# EAGLE design Universal_Board_Side_Mount (EAGLE 9.6.2)
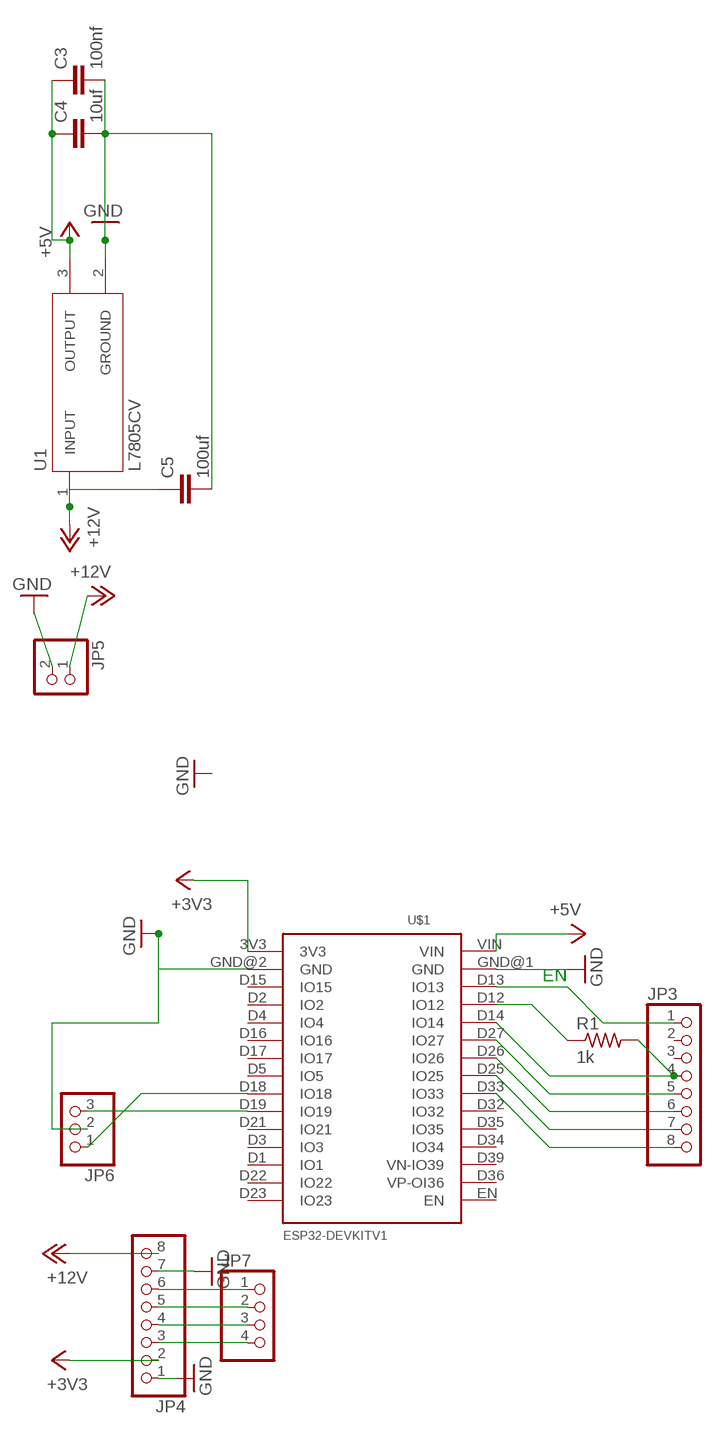
[diagram p0: schematic, sheet 1]

## Parts
C3  100nf  C2,5-3  [C2.5-3]
C4  10uf  C2,5-3  [C2.5-3]
C5  100uf  C2,5-3  [C2.5-3]
JP3  PINHD-1X8  [1X08]
JP4  PINHD-1X8  [1X08]
JP5  PINHD-1X2  [1X02]
JP6  PINHD-1X3  [1X03]
JP7  PINHD-1X4  [1X04]
R1  1k  R-US_0204/7  [0204/7]
U1  L7805CV  [TO255P1040X460X1968-3]
U$1  ESP32DEVKITV1  [ESP32-DEVKITV1]

## Nets
+3V3: JP4.2 U$1.3V3
+5V: C3.1 C4.1 U1.3(OUTPUT) U$1.VIN
+12V: C5.1 JP4.8 JP5.1 U1.1(INPUT)
GND: C3.2 C4.2 C5.2 JP4.1 JP4.7 JP5.2 JP6.2 U1.2(GROUND) U$1.GND@1(GND) U$1.GND@2(GND)
N$1: JP3.4 R1.2 U$1.D14(IO14)
N$2: JP3.1 U$1.D13(IO13)
N$3: R1.1 U$1.D12(IO12)
N$4: JP3.5 U$1.D27(IO27)
N$5: JP3.6 U$1.D26(IO26)
N$6: JP3.7 U$1.D25(IO25)
N$7: JP3.8 U$1.D33(IO33)
N$8: JP4.6 JP7.1
N$9: JP4.5 JP7.2
N$10: JP4.4 JP7.3
N$11: JP4.3 JP7.4
N$13: JP6.3 U$1.D19(IO19)
N$15: JP6.1 U$1.D18(IO18)
Unconnected: JP3.2 JP3.3 U$1.D1(IO1) U$1.D2(IO2) U$1.D3(IO3) U$1.D4(IO4) U$1.D5(IO5) U$1.D15(IO15) U$1.D16(IO16) U$1.D17(IO17) U$1.D21(IO21) U$1.D22(IO22) U$1.D23(IO23) U$1.D32(IO32) U$1.D34(IO34) U$1.D35(IO35) U$1.D36(VP-OI36) U$1.D39(VN-IO39) U$1.EN

## Notes on the sheet
- EN

## Library data of the parts
C3-C5 = capacitor-wima:C: CAPACITOR naming: grid - package width
JP3 JP4 = pinhead:PINHD-1X8: PIN HEADER
JP5 = pinhead:PINHD-1X2: PIN HEADER
JP6 = pinhead:PINHD-1X3: PIN HEADER
JP7 = pinhead:PINHD-1X4: PIN HEADER
R1 = rcl:R-US_: RESISTOR, American symbol; SPICEPREFIX: R
U1 = L7805CV:L7805CV: Standard Regulator Pos 5V 1.5A 3-Pin(3+Tab) TO-220 Standard Regulator Pos 5V 1.5A 3-Pin(3+Tab) TO-220; AVAILABILITY: Unavailable; DESCRIPTION: Linear Voltage Regulator IC 1 Output 1.5A TO-220; MF: STMicroelectronics; MP: L7805CV; PACKAGE: TO-220 STMicroelectronics; PRICE: None
U$1 = ESP32-DEVKITV1:ESP32DEVKITV1

## Board
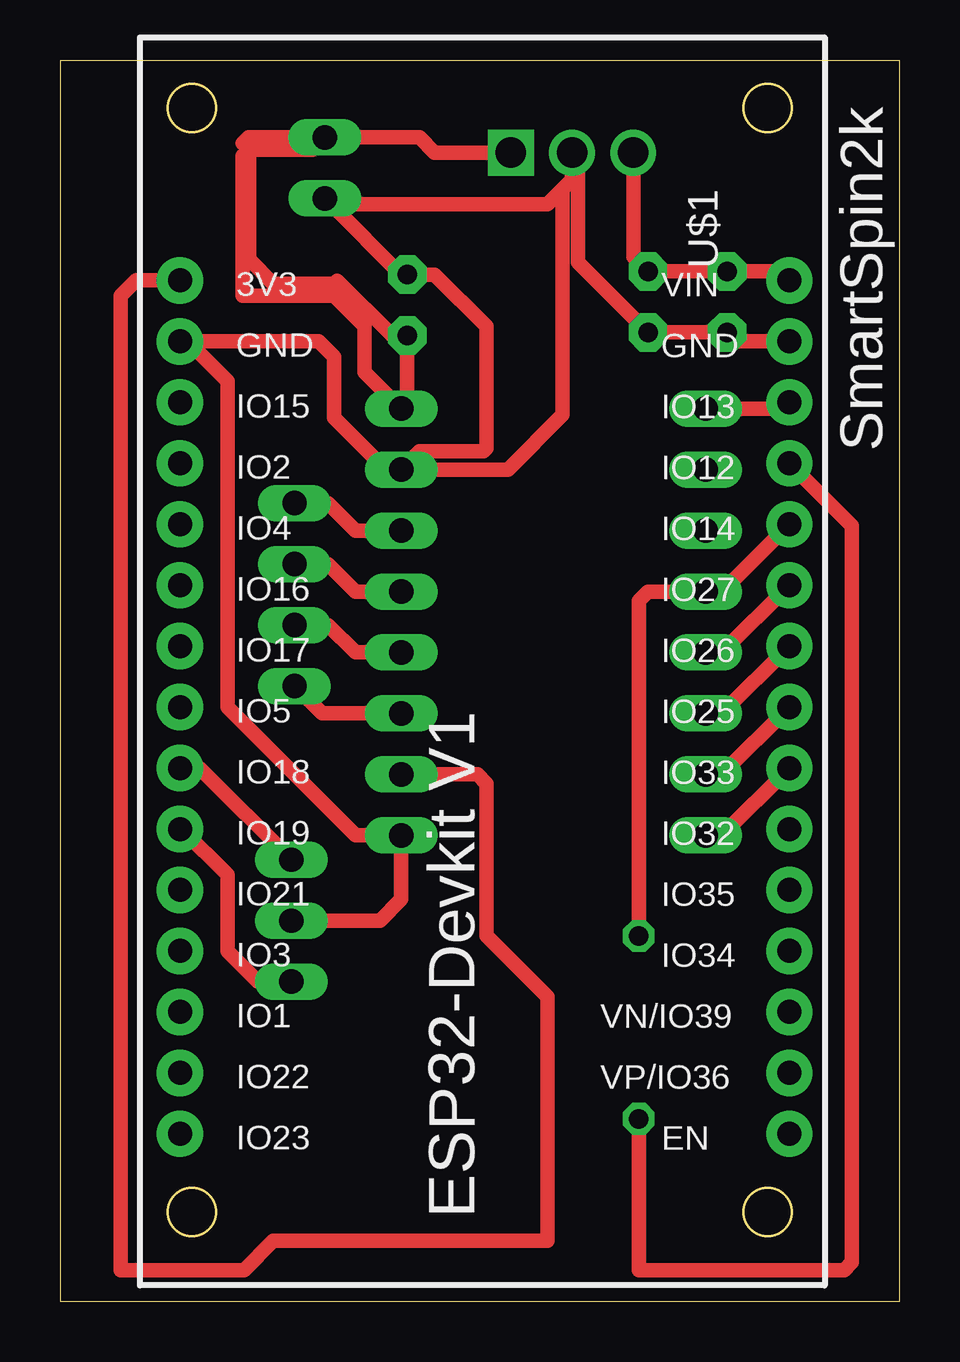
[diagram p1: board, top side]
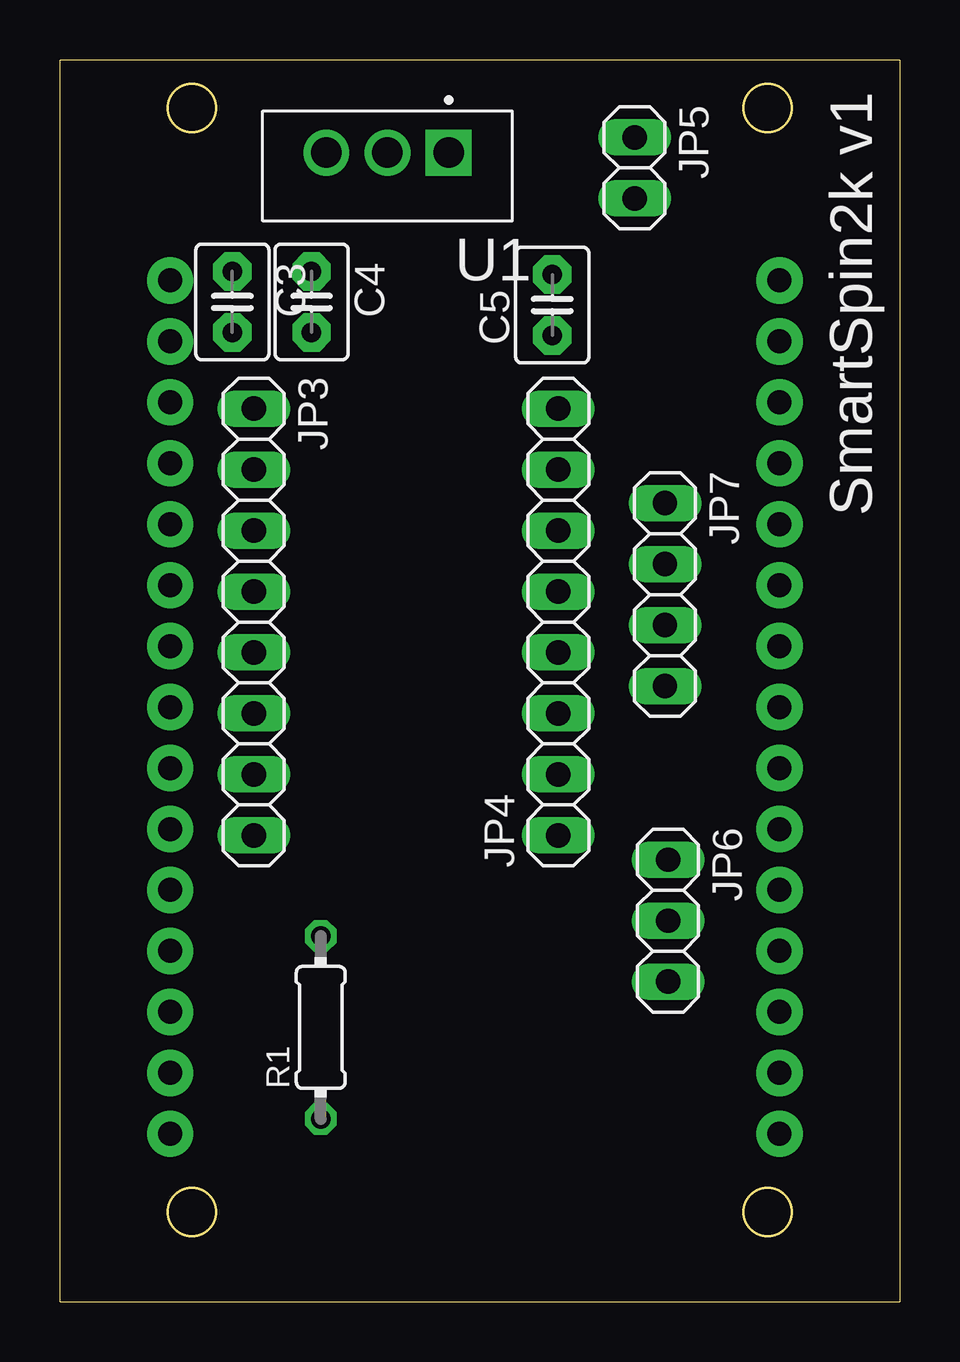
[diagram p2: board, bottom side, seen from below]

Size 35 x 51.74 mm. Coordinates in mm from the lower left corner, seen from the top.
Outline: 35,0 35,51.74 0,51.74 0,0 35,0
Outline: circle at 29.5,3.74 radius 1
Outline: circle at 29.5,49.74 radius 1
Outline: circle at 5.5,3.74 radius 1
Outline: circle at 5.5,49.74 radius 1
Copper layers (1*16): Top 0.035mm / dielectric 1.5mm / Bottom 0.035mm
Design rules "default *": minimum track width 24mil, minimum drill 0.35mm, track to track 10mil, track to pad 10mil, pad to pad 6mil, via to via 6mil, smd to smd 6mil, copper to edge 40mil, drill to drill 6mil, minimum pad ring 10mil, minimum via ring 8mil, stop-mask expansion 4mil, vias tented up to drill 0mil, thermal gap 10mil

### Footprints (pad centres in the part's own frame; a part is rotated, then mirrored left to right if it is on the bottom)
C2.5-3 = drill 0.813 pad 1.6 octagon: 1 -1.27,0; 2 1.27,0
1X08 = drill 1.016 long: 1 -8.89,0; 2 -6.35,0; 3 -3.81,0; 4 -1.27,0; 5 1.27,0; 6 3.81,0; 7 6.35,0; 8 8.89,0
1X02 = drill 1.016 long: 1 -1.27,0; 2 1.27,0
1X03 = drill 1.016 long: 1 -2.54,0; 2 0,0; 3 2.54,0
1X04 = drill 1.016 long: 1 -3.81,0; 2 -1.27,0; 3 1.27,0; 4 3.81,0
0204/7 = drill 0.813 octagon: 1 -3.81,0; 2 3.81,0
TO255P1040X460X1968-3 = drill 1.27 pad 1.91 square: 1 0,0 | drill 1.27 pad 1.91: 2 2.55,0; 3 5.1,0
ESP32-DEVKITV1 = drill 1 pad 1.93: 3V3 -16.52,-12.27; D1 13.96,-12.27; D2 -8.9,-12.27; D3 11.42,-12.27; D4 -6.36,-12.27; D5 1.26,-12.27; D12 -8.9,13.135; D13 -11.44,13.135; D14 -6.36,13.135; D15 -11.44,-12.27; D16 -3.82,-12.27; D17 -1.28,-12.27; D18 3.8,-12.27; D19 6.34,-12.27; D21 8.88,-12.27; D22 16.5,-12.27; D23 19.04,-12.27; D25 1.26,13.135; D26 -1.28,13.135; D27 -3.82,13.135; D32 6.34,13.135; D33 3.8,13.135; D34 11.42,13.135; D35 8.88,13.135; D36 16.5,13.135; D39 13.96,13.135; EN 19.04,13.135; GND@1 -13.98,13.135; GND@2 -13.98,-12.27; VIN -16.52,13.135

### Placement (x,y rotation side)
C3  27.81,41.66 270 bottom
C4  24.51,41.66 270 bottom
C5  14.48,41.53 90 bottom
JP3  26.92,28.32 270 bottom
JP4  14.22,28.32 90 bottom
JP5  11.05,47.24 270 bottom
JP6  9.65,15.88 270 bottom
JP7  9.78,29.46 270 bottom
R1  24.13,11.43 90 bottom
U1  18.8,47.88 180 bottom
U$1  17.27,26.04 270 top

### Tracks (layer width: path | path; a pad name or v marks a point on that pad's centre or on a via)
+3V3
  Top 0.61: U$1.3V3 3.19,42.55 2.54,41.91 2.54,1.32 7.67,1.32 8.89,2.54 20.32,2.54 20.32,12.7 17.78,15.24 17.78,21.59 17.4,21.97 JP4.2
+5V
  Top 0.61: U1.3 23.9,43.54 C4.1 C3.1 30.04,42.93 U$1.VIN
+12V
  Top 0.61: U1.1 15.62,47.88 14.99,48.51 JP5.1 | 7.62,48.26 7.87,48.51 JP5.1 | 7.88,48 7.62,47.74 7.62,41.91 11.43,41.91 12.7,40.64 12.7,38.73 JP4.8 14.48,37.47 C5.1 13.84,40.26 11.56,42.55 11.43,42.42 8.89,42.42 7.88,43.43 7.88,48 | JP5.1 10.54,48 7.88,48
GND
  Top 0.61: 20.95,46.35 21.35,46.75 U1.2 21.59,47.63 21.59,43.31 C4.2 C3.2 28.18,40.02 U$1.GND@1 | 20.95,46.35 20.32,45.72 11.3,45.72 | 11.3,45.72 JP5.2 | JP4.7 13.59,34.67 11.43,36.83 11.43,39.37 10.79,40.02 U$1.GND@2 5.32,40.02 6.99,38.35 6.99,24.77 12.32,19.43 JP4.1 14.22,16.76 13.34,15.88 JP6.2 | 14.61,34.29 JP4.7 | JP4.7 18.67,34.67 20.95,36.96 20.95,46.35 | 11.3,45.72 14.22,42.8 C5.2 15.62,42.8 17.78,40.64 17.78,35.56 17.65,35.43 14.99,35.43 JP4.7
N$1
  Top 0.61: U$1.D14 27.6,29.59 JP3.4 24.51,29.59 24.13,29.21 R1.2
N$2
  Top 0.61: U$1.D13 30.14,37.21 JP3.1
N$3
  Top 0.61: U$1.D12 33.02,32.32 33.02,1.65 32.69,1.32 24.13,1.32 R1.1
N$4
  Top 0.61: JP3.5 27.6,27.05 U$1.D27
N$5
  Top 0.61: JP3.6 27.6,24.51 U$1.D26
N$6
  Top 0.61: JP3.7 27.6,21.97 U$1.D25
N$7
  Top 0.61: JP3.8 27.6,19.43 U$1.D33
N$8
  Top 0.61: JP4.6 12.32,32.13 11.18,33.27 JP7.1
N$9
  Top 0.61: JP4.5 12.32,29.59 11.18,30.73 JP7.2
N$10
  Top 0.61: JP4.4 12.32,27.05 11.18,28.19 JP7.3
N$11
  Top 0.61: JP4.3 10.92,24.51 JP7.4
N$13
  Top 0.61: JP6.3 8.26,13.34 6.99,14.61 6.99,17.78 5.07,19.7 U$1.D19
N$15
  Top 0.61: JP6.1 5.83,22.23 U$1.D18

### Text on the board
tNames: SmartSpin2k
bNames: SmartSpin2k v1